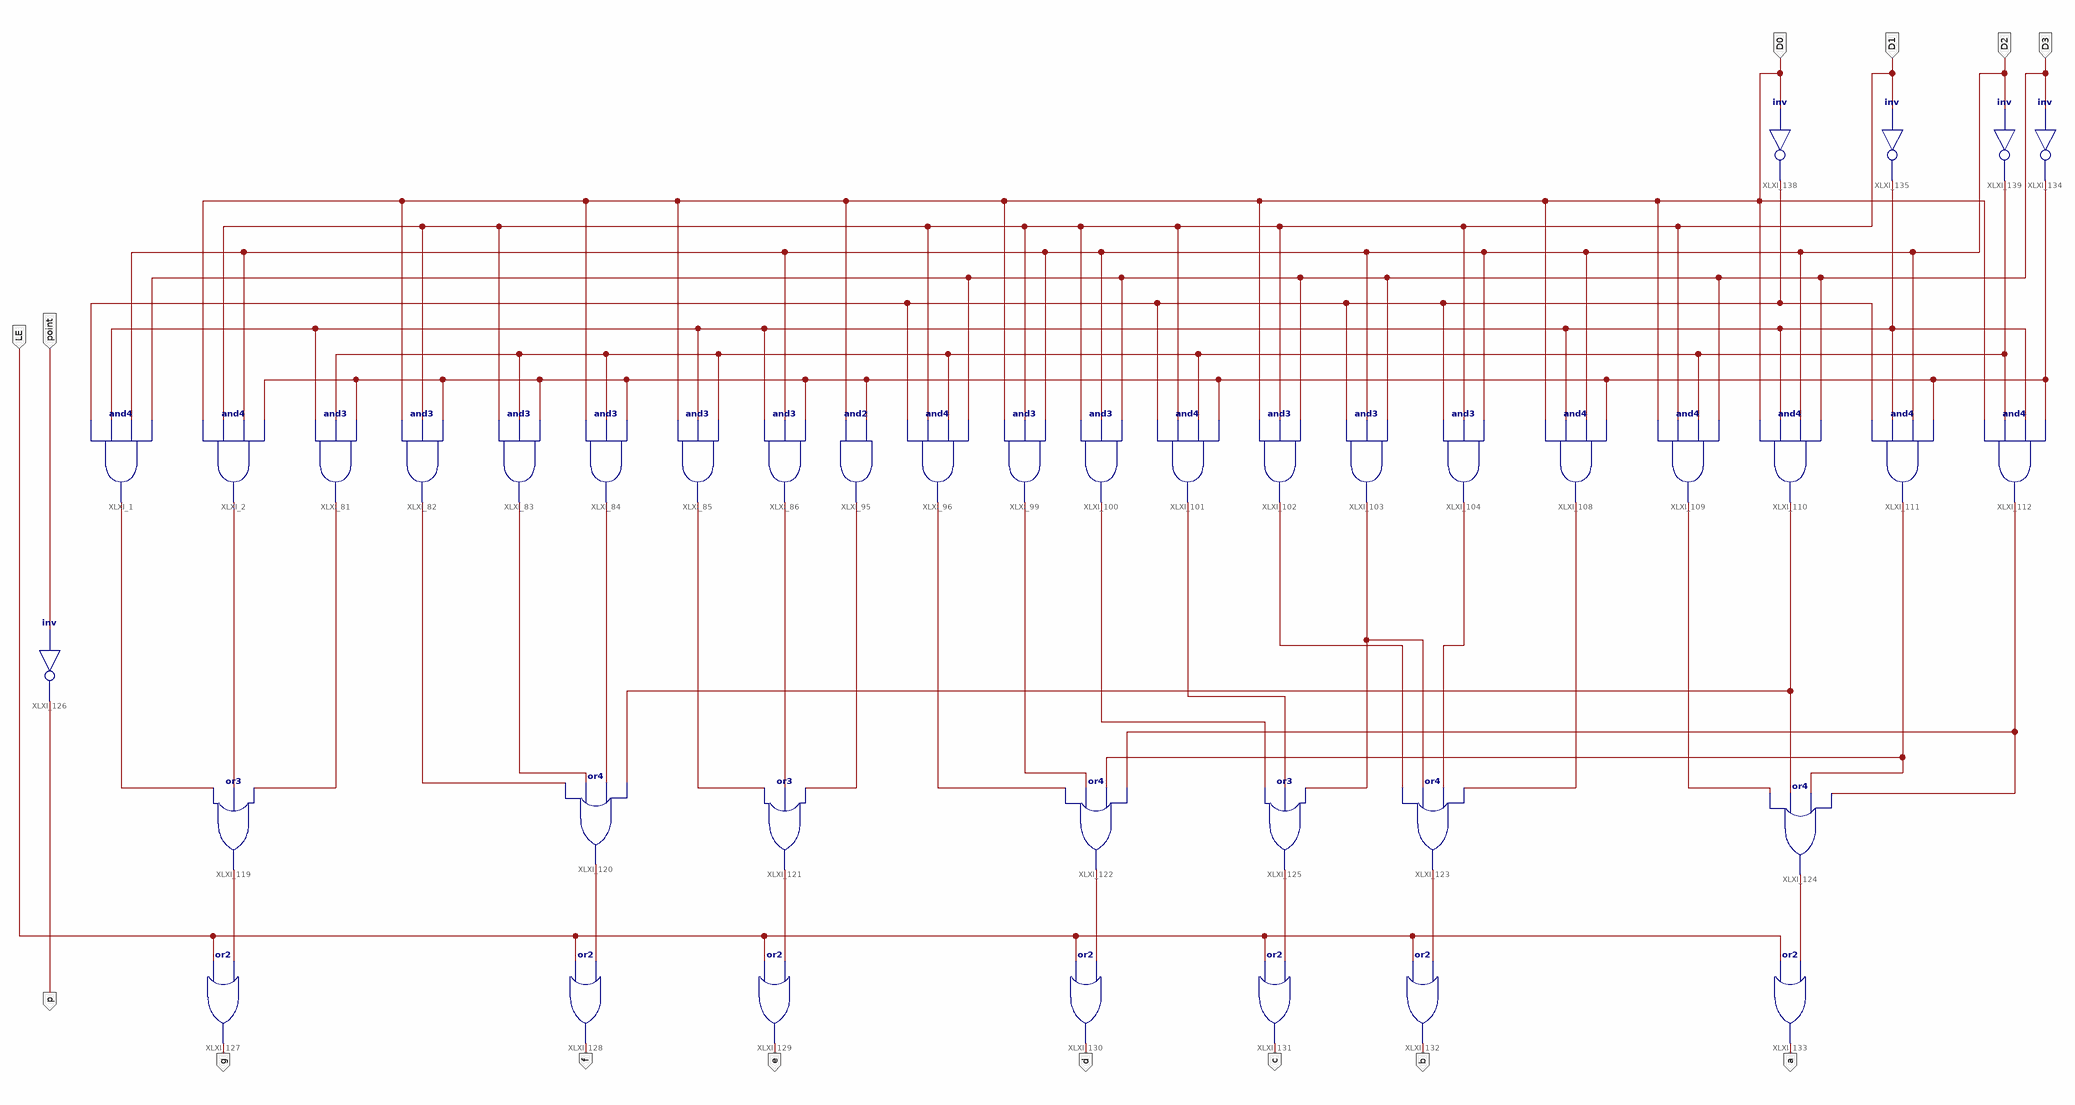
[diagram p0: schematic sheet 1]
// Xilinx ISE schematic MyMC14495.sch (kintex7) as structural Verilog: 40 symbols, 14 ports
module MyMC14495 (
  input  LE,
  input  point,
  input  D3,
  input  D1,
  input  D0,
  input  D2,
  output p,
  output g,
  output f,
  output e,
  output b,
  output c,
  output d,
  output a
);

  wire XLXN_1, XLXN_2, XLXN_4, XLXN_5, XLXN_9, XLXN_10, XLXN_11, XLXN_12, XLXN_14, XLXN_16, XLXN_17, XLXN_21,
       XLXN_22, XLXN_24, XLXN_25, XLXN_26, XLXN_27, XLXN_28, XLXN_30, XLXN_35, XLXN_38, XLXN_47, XLXN_48,
       XLXN_49, XLXN_50, XLXN_51, XLXN_52, XLXN_53, XLXN_63, XLXN_64, XLXN_65, XLXN_68;

  and XLXI_1 (XLXN_1, XLXN_65, XLXN_64, D2, D3);
  and XLXI_2 (XLXN_2, D0, D1, D2, XLXN_68);
  and XLXI_81 (XLXN_4, XLXN_64, XLXN_63, XLXN_68);
  and XLXI_82 (XLXN_5, D0, D1, XLXN_68);
  and XLXI_83 (XLXN_9, D1, XLXN_63, XLXN_68);
  and XLXI_84 (XLXN_10, D0, XLXN_63, XLXN_68);
  and XLXI_85 (XLXN_11, D0, XLXN_64, XLXN_63);
  and XLXI_86 (XLXN_12, XLXN_64, D2, XLXN_68);
  and XLXI_95 (XLXN_14, D0, XLXN_68);
  and XLXI_96 (XLXN_16, XLXN_65, D1, XLXN_63, D3);
  and XLXI_99 (XLXN_17, D0, D1, D2);
  and XLXI_100 (XLXN_21, D1, D2, D3);
  and XLXI_101 (XLXN_22, XLXN_65, D1, XLXN_63, XLXN_68);
  and XLXI_102 (XLXN_24, D0, D1, D3);
  and XLXI_103 (XLXN_25, XLXN_65, D2, D3);
  and XLXI_104 (XLXN_26, XLXN_65, D1, D2);
  and XLXI_112 (XLXN_35, D0, XLXN_63, XLXN_64, XLXN_68);
  and XLXI_108 (XLXN_27, D0, XLXN_64, D2, XLXN_68);
  and XLXI_109 (XLXN_28, D0, D1, XLXN_63, D3);
  and XLXI_110 (XLXN_38, D0, XLXN_64, D2, D3);
  and XLXI_111 (XLXN_30, XLXN_65, XLXN_64, D2, XLXN_68);
  or XLXI_119 (XLXN_53, XLXN_1, XLXN_2, XLXN_4);
  or XLXI_120 (XLXN_52, XLXN_5, XLXN_9, XLXN_10, XLXN_38);
  or XLXI_121 (XLXN_51, XLXN_11, XLXN_12, XLXN_14);
  or XLXI_122 (XLXN_50, XLXN_16, XLXN_17, XLXN_30, XLXN_35);
  or XLXI_123 (XLXN_48, XLXN_24, XLXN_25, XLXN_26, XLXN_27);
  or XLXI_124 (XLXN_47, XLXN_28, XLXN_38, XLXN_30, XLXN_35);
  or XLXI_125 (XLXN_49, XLXN_21, XLXN_22, XLXN_25);
  not XLXI_126 (p, point);
  or XLXI_127 (g, LE, XLXN_53);
  or XLXI_128 (f, LE, XLXN_52);
  or XLXI_129 (e, LE, XLXN_51);
  or XLXI_130 (d, LE, XLXN_50);
  or XLXI_131 (c, LE, XLXN_49);
  or XLXI_132 (b, LE, XLXN_48);
  or XLXI_133 (a, LE, XLXN_47);
  not XLXI_135 (XLXN_64, D1);
  not XLXI_134 (XLXN_68, D3);
  not XLXI_138 (XLXN_65, D0);
  not XLXI_139 (XLXN_63, D2);
endmodule
